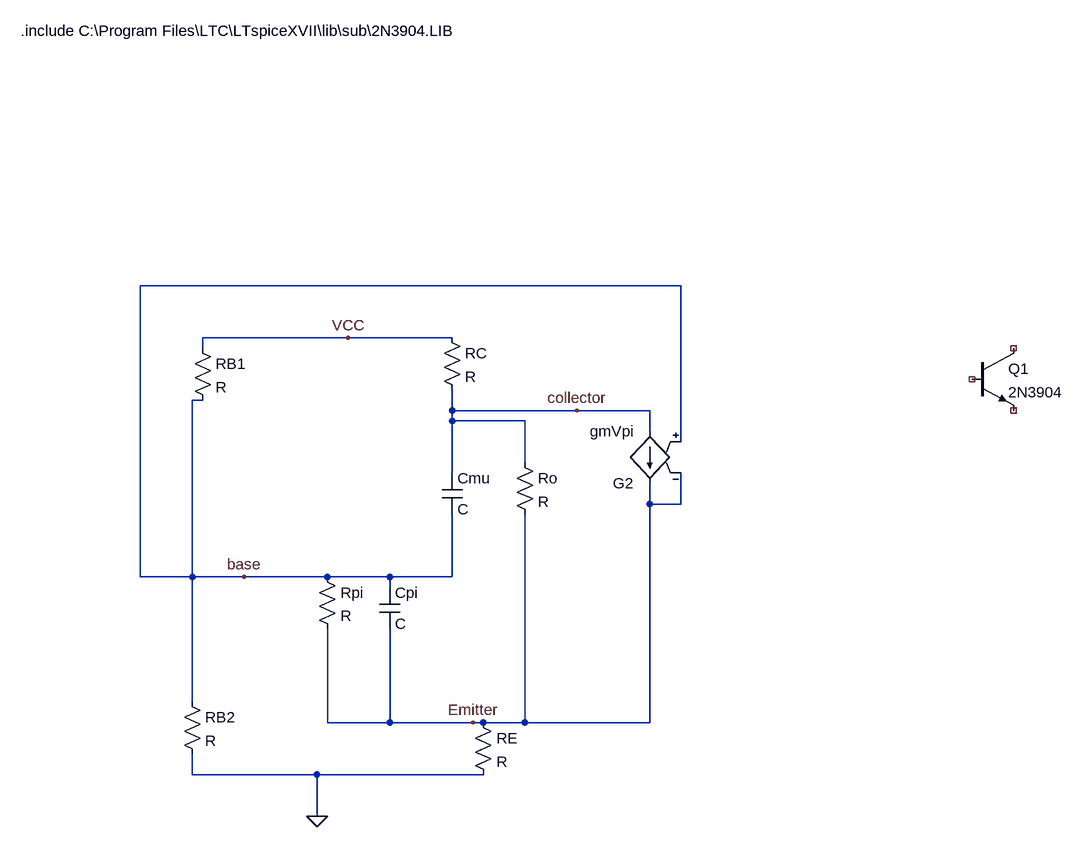
[diagram p0: schematic mp2 task1 C biased.asc]
mp2 task1 C biased.asc, the LTspice schematic file:
Version 4
SHEET 1 1472 804
WIRE 800 -96 -32 -96
WIRE 288 -16 64 -16
WIRE 448 -16 288 -16
WIRE 64 0 64 -16
WIRE 64 80 48 80
WIRE 448 96 448 64
WIRE 640 96 448 96
WIRE 752 96 640 96
WIRE 448 112 448 96
WIRE 560 112 448 112
WIRE 752 128 752 96
WIRE 800 144 800 -96
WIRE 560 176 560 112
WIRE 448 192 448 112
WIRE 752 240 752 208
WIRE 800 240 800 192
WIRE 800 240 752 240
WIRE -32 352 -32 -96
WIRE 48 352 48 80
WIRE 48 352 -32 352
WIRE 128 352 48 352
WIRE 256 352 128 352
WIRE 352 352 256 352
WIRE 448 352 448 256
WIRE 448 352 352 352
WIRE 352 368 352 352
WIRE 48 544 48 352
WIRE 256 576 256 432
WIRE 352 576 352 432
WIRE 352 576 256 576
WIRE 480 576 352 576
WIRE 496 576 480 576
WIRE 560 576 560 256
WIRE 560 576 496 576
WIRE 752 576 752 240
WIRE 752 576 560 576
WIRE 48 656 48 624
WIRE 240 656 48 656
WIRE 496 656 240 656
WIRE 240 720 240 656
FLAG 240 720 0
FLAG 288 -16 VCC
FLAG 480 576 Emitter
FLAG 640 96 collector
FLAG 128 352 base
SYMBOL res 48 -16 R0
SYMATTR InstName RB1
SYMBOL res 432 -32 R0
SYMATTR InstName RC
SYMBOL res 32 528 R0
SYMATTR InstName RB2
SYMBOL res 480 560 R0
SYMATTR InstName RE
SYMBOL cap 432 192 R0
SYMATTR InstName Cmu
SYMBOL res 240 336 R0
SYMATTR InstName Rpi
SYMBOL cap 336 368 R0
SYMATTR InstName Cpi
SYMBOL res 544 160 R0
SYMATTR InstName Ro
SYMBOL g2 752 224 R180
SYMATTR InstName G2
SYMATTR Value gmVpi
SYMBOL npn 1248 0 R0
SYMATTR InstName Q1
SYMATTR Value 2N3904
TEXT -216 -488 Left 2 !.include C:\\Program Files\\LTC\\LTspiceXVII\\lib\\sub\\2N3904.LIB

The netlist it stands for:
* mp2 task1 C biased.asc
RB1 VCC base R
RC VCC collector R
RB2 base 0 R
RE Emitter 0 R
Cmu collector base C
Rpi base Emitter R
Cpi base Emitter C
Ro collector Emitter R
G2 collector Emitter base Emitter gmVpi
Q1 NC_01 NC_02 NC_03 0 2N3904
.model NPN NPN
.model PNP PNP
.lib standard.bjt
.include C:\Program Files\LTC\LTspiceXVII\lib\sub\2N3904.LIB
.backanno
.end